# EasyEDA Pro project Blaster.eprj

# Schematic Blaster
Board Name: Blaster; Create Date: 2022-11-13; Page Name: Core; Project Name: Blaster; Schematic Name: Blaster; Update Date: 2023-08-04; Company: 嘉立创EDA; Page Size: A4; Version: V1.0
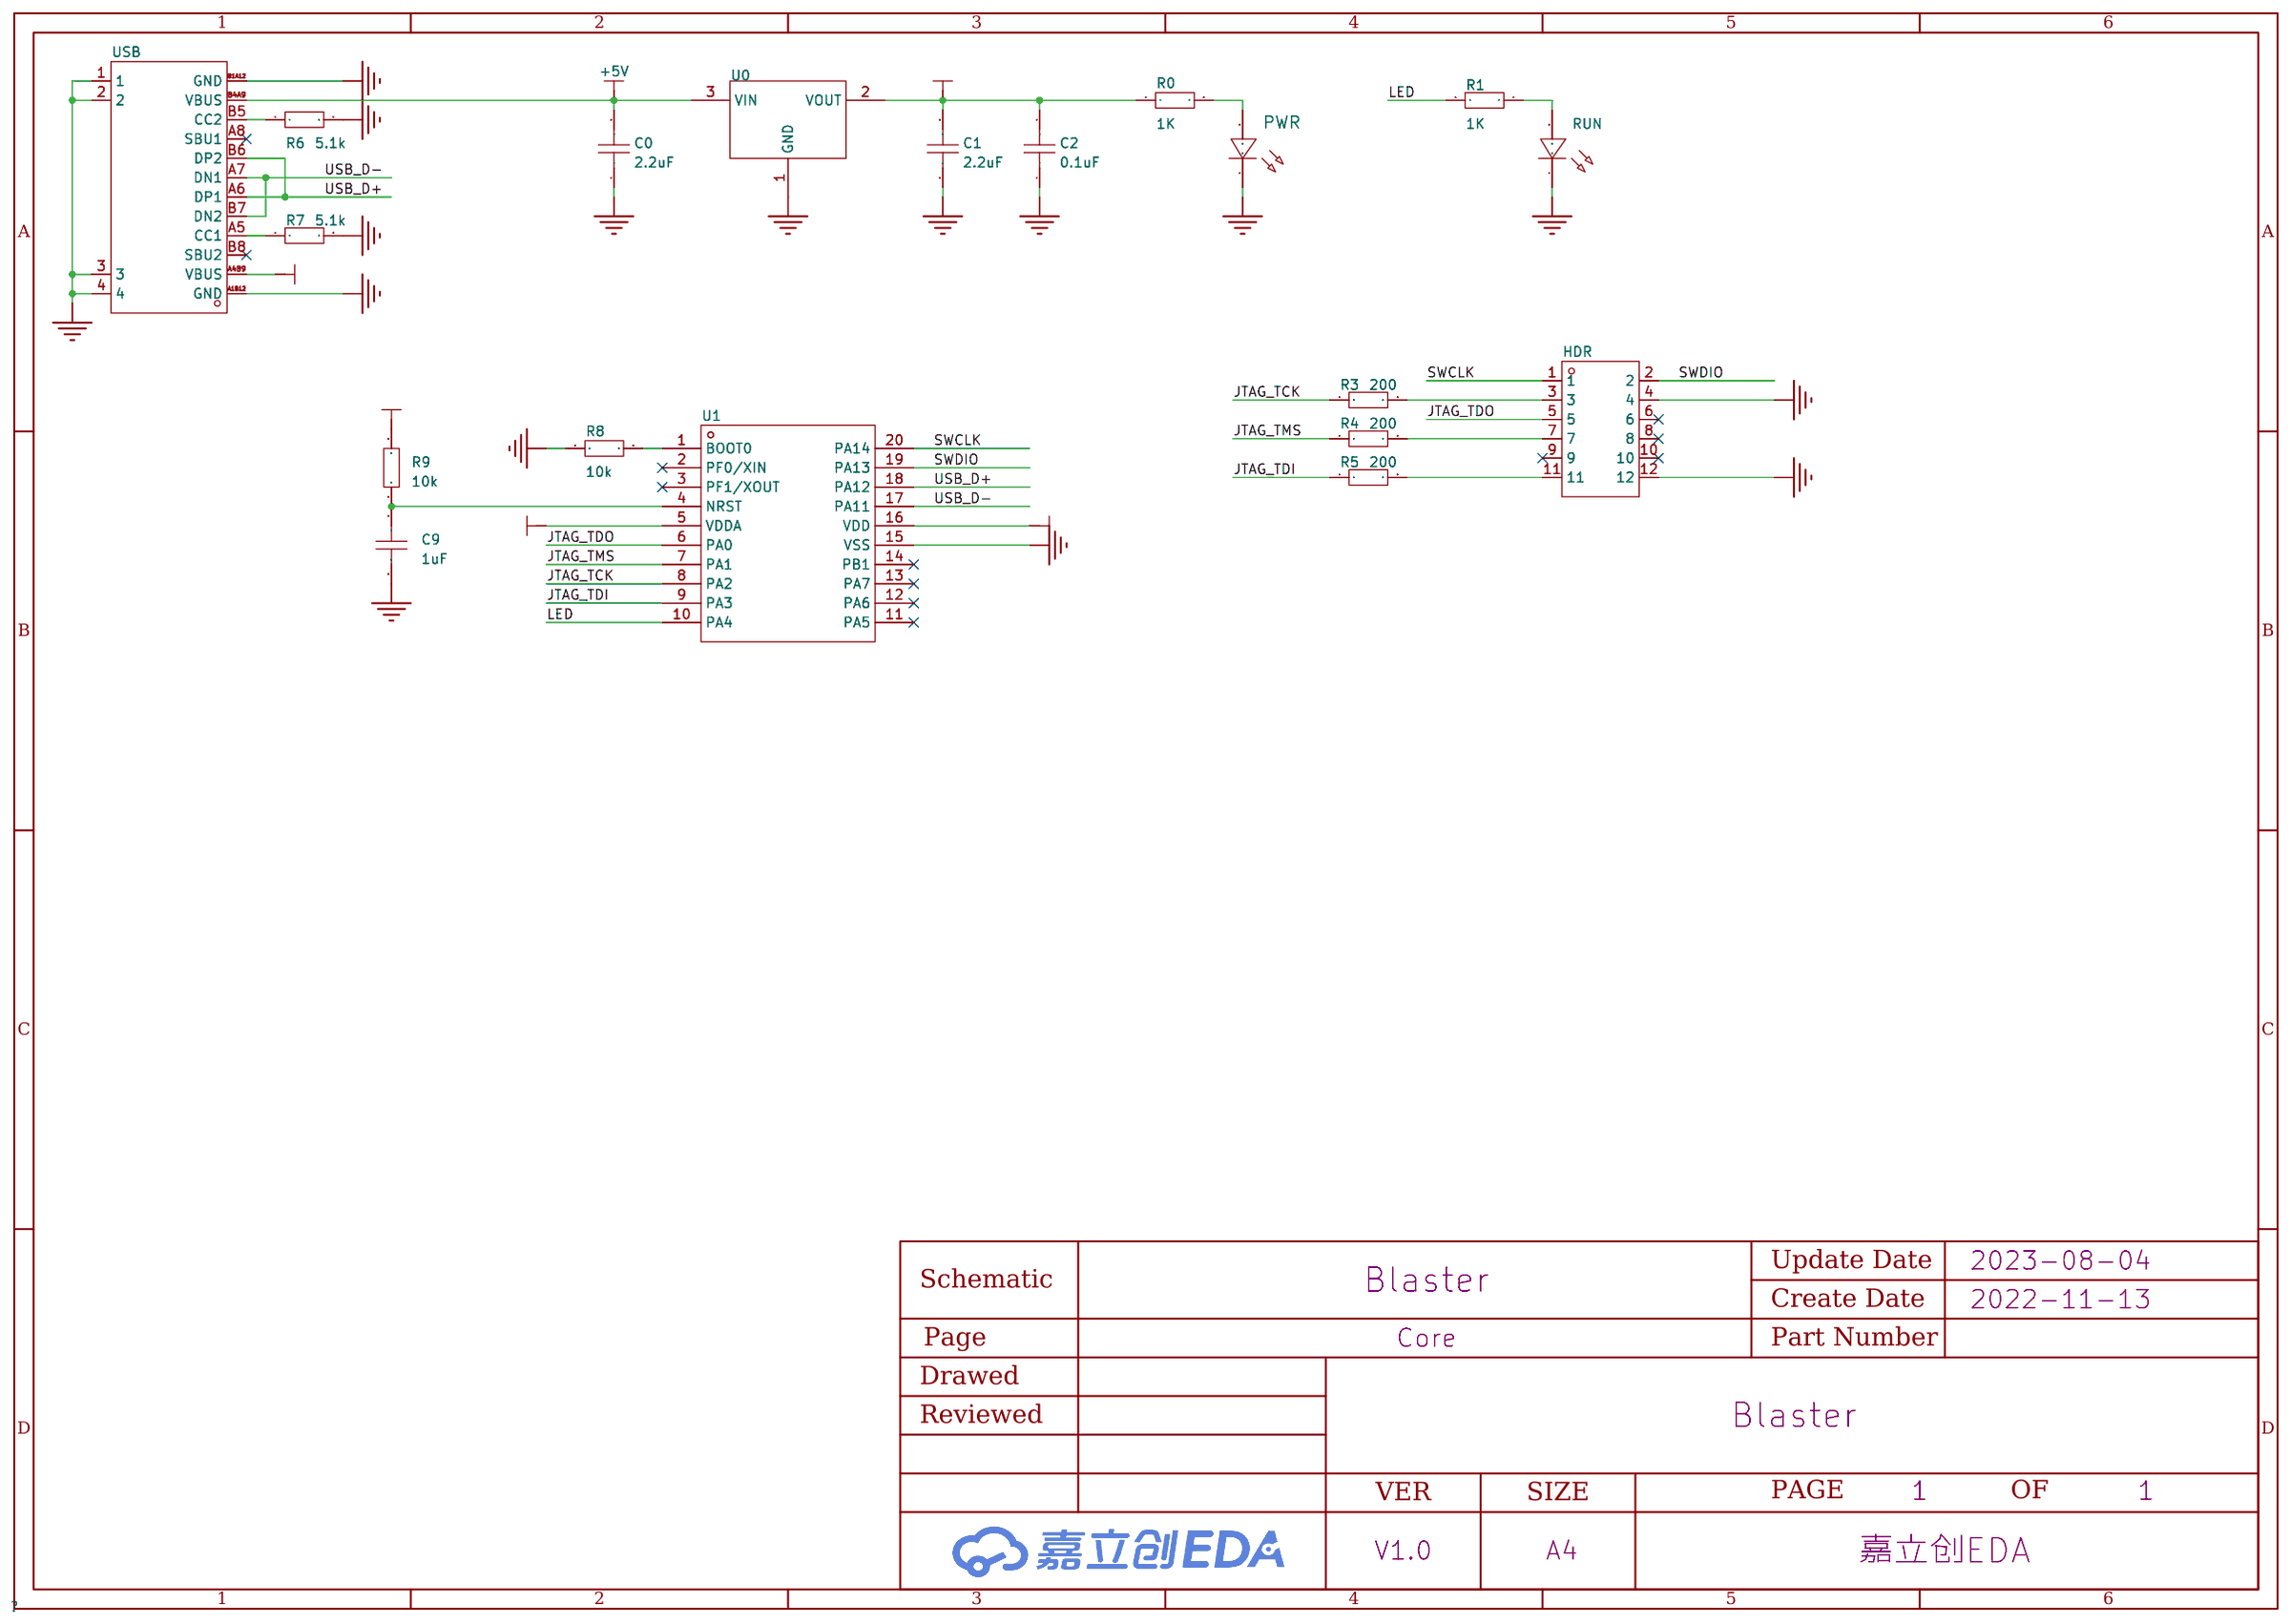
[diagram p0: schematic sheet]

## Parts
C0  2.2uF  [C0603]
C1  2.2uF  [C0603]
C2  0.1uF  [C0603]
C9  1uF  [C0603]
HDR  -  [HDR-SMD_2X6P-P2.54]
PWR  -  [LED0603-RD_BLUE]
R0  1K  [R0603]
R1  1K  [R0603]
R3  200  [R0603]
R4  200  [R0603]
R5  200  [R0603]
R6  5.1k  [R0603]
R7  5.1k  [R0603]
R8  10k  [R0603]
R9  10k  [R0603]
RUN  -  [LED0603-RD]
U0  HT7233  [SOT-23-3_L2.9-W1.6-P1.90-LS2.8-BR]
U1  -  [TSSOP-20_L6.5-W4.4-P0.65-LS6.4-BL]
USB  USB-TYPE-C-017  [USB-TYPE-C-SMD_C9900008089]

## Library data of the parts
C0-C2 C9 = CAP_0603: 容值:100nF;精度:±10%;额定电压:50V;温度系数:X7R;; Supplier Footprint: 0603
HDR = HDR-M_2.54_2x6: Supplier Part: C30734; Supplier Footprint: 插件,P=2.54mm
PWR = LED_0603-R: 发光颜色:红灯;二极管配置:-;透镜颜色:无色透明;主波长:617.5nm;峰值波长:632nm;色温:-;光通量(25时):-;测试电流:5mA;正向电压(VF):2.2V;发光强度:28.5mcd;功率:60mW;发光角度:120°;安装方式:-;工作温度:-40~+85;; Supplier Footprint: 0603; Supplier Part: C72044
R0 R1 R3-R9 = Res_0603: Supplier Footprint: 0603
RUN = LED_0603-G: 照明颜色:翠绿;色温 - CCT（K）:-;主波长/色坐标:520~535nm;; Supplier Footprint: 0603; Supplier Part: C72043
U0 = HT7233: 输出类型:固定;输出极性:正;输出通道数:1;最大输入电压:8V;输出电压:3.3V;压差:300mV@(300mA);静态电流(地电流):-;输出电流:300mA;电源纹波抑制比(PRSS):-;; LCSC Part Name: Vin=8V Vout=3.3V 300mA; Supplier Part: C47970; Manufacturer: HOLTEK(台湾合泰/盛群); Supplier Footprint: SOT-23(SOT-23-3); JLCPCB Part Class: 扩展库; Datasheet: https://atta.szlcsc.com/upload/public/pdf/source/20150618/1457707321217.pdf; Supplier: LCSC; Output Type: 固定; Output Polarity: 正; Number of Outputs: 1; Maximum Input Voltage: 8V; Output Voltage: 3.3V; Dropout Voltage: 300mV@(300mA); Output Current: 300mA
U1 = AT32F425F8
USB = USB-TYPE-C-017: 连接器类型:Type-C;标准:-;公母:母座;触点数量:16;端口数量:1;安装方式:卧贴;额定电流 - 电源:3A;工作温度范围:-25~+85;; Supplier Part: C2927037; Manufacturer: DEALON(德艺隆); Supplier Footprint: SMD; JLCPCB Part Class: 扩展库; Datasheet: https://atta.szlcsc.com/upload/public/pdf/source/20211217/653222EE5174722C9DFE2966329956D8.pdf; Supplier: LCSC; Connector Type: Type-C; Gender: 母座; Number of Contacts: 16; Number of Ports: 1; Mounting Style: 卧贴; Current Rating - Power (Max): 3A; Operating Temperature Range: -25~+85

## Nets
+3.3V: C1.2 C2.2 R0.1 R9.2 U0.2(VOUT) U1.5(VDDA) U1.16(VDD)
+5V: C0.2 U0.3(VIN) USB.A4B9(VBUS) USB.B4A9(VBUS)
GND: C0.1 C1.1 C2.1 C9.2 HDR.4 HDR.12 PWR.1(C) R6.2 R7.2 R8.1 RUN.1(C) U0.1(GND) U1.15(VSS) USB.1 USB.2 USB.3 USB.4 USB.A1B12(GND) USB.B1A12(GND)
JTAG_TCK: R3.1 U1.8(PA2)
JTAG_TDI: R5.1 U1.9(PA3)
JTAG_TDO: HDR.5 U1.6(PA0)
JTAG_TMS: R4.1 U1.7(PA1)
LED: R1.2 U1.10(PA4)
SWCLK: HDR.1 U1.20(PA14)
SWDIO: HDR.2 U1.19(PA13)
USB_D+: U1.18(PA12) USB.A6(DP1) USB.B6(DP2)
USB_D-: U1.17(PA11) USB.A7(DN1) USB.B7(DN2)
$1N2511: R7.1 USB.A5(CC1)
$1N2512: R6.1 USB.B5(CC2)
$1N2528: PWR.2(A) R0.2
$1N2541: C9.1 R9.1 U1.4(NRST)
$1N2568: HDR.7 R4.2
$1N2571: HDR.3 R3.2
$1N2578: HDR.11 R5.2
$1N4668: R8.2 U1.1(BOOT0)
$1N8802: R1.1 RUN.2(A)

Not connected (* = marked no-connect by the designer): HDR 6* 8* 9* 10*; U1 2(PF0/XIN)* 3(PF1/XOUT)* 11(PA5)* 12(PA6)* 13(PA7)* 14(PB1)*; USB A8(SBU1)* B8(SBU2)*

# Board Blaster
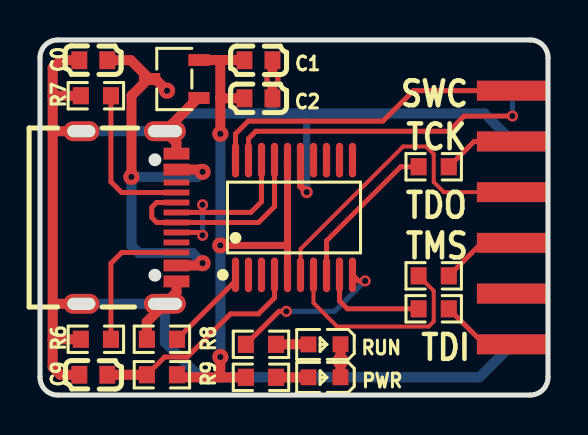
[diagram p1: board, top side]
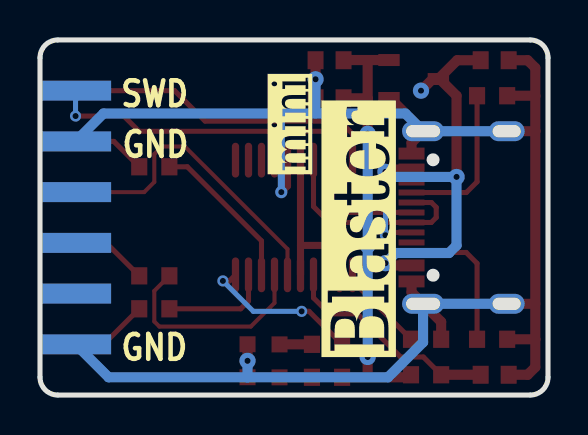
[diagram p2: board, bottom side, seen from below]

Outline 25.4 x 17.78 mm; copper layers: Top Layer, Bottom Layer. Coordinates in mm from the lower left corner of the outline.
Outline path: 0,16.89 0,0.89 arc(0.26,0.26) 0.89,0 24.51,0 arc(25.14,0.26) 25.4,0.89 25.4,16.89 arc(25.14,17.52) 24.51,17.78 0.89,17.78 arc(0.26,17.52) 0,16.89
Stack: Top Layer 0.035mm / Dielectric1 1.51mm FR4 er 4.5 / Bottom Layer 0.035mm

## Design rules (mm)
spacing safeClearance (default): track to track 0.152, other pairs 0.152 to 0.3
track width trackWidth (default): min 0.127, default 0.254, max 2.54
differential pair differentialPair (default): width min 0.127, default 0.254, max 2.54; gap min 0.152, default 0.152
via viaSize (default): diameter min 0.5, default 0.61, max 10; hole min 0.3, default 0.305, max 6

## Placement (name value [footprint] x y rotation side)
C0  2.2uF  [C0603]  2.67 16.76 0 top
C1  2.2uF  [C0603]  10.92 16.76 180 top
C2  0.1uF  [C0603]  10.92 14.86 180 top
C9  1uF  [C0603]  2.67 1.02 180 top
HDR  -  [HDR-SMD_2X6P-P2.54]  23.62 15.24 0 top
PWR  -  [LED0603-RD_BLUE]  14.22 0.89 180 top
R0  1K  [R0603]  11.05 0.89 0 top
R1  1K  [R0603]  11.05 2.54 180 top
R3  200  [R0603]  19.69 11.43 0 top
R4  200  [R0603]  19.69 5.97 0 top
R5  200  [R0603]  19.69 4.32 0 top
R6  5.1k  [R0603]  2.79 2.79 180 top
R7  5.1k  [R0603]  2.79 14.99 180 top
R8  10k  [R0603]  6.1 2.79 0 top
R9  10k  [R0603]  6.1 1.02 0 top
RUN  -  [LED0603-RD]  14.22 2.54 180 top
U0  HT7233  [SOT-23-3_L2.9-W1.6-P1.90-LS2.8-BR]  6.72 15.82 0 top
U1  -  [TSSOP-20_L6.5-W4.4-P0.65-LS6.4-BL]  12.7 8.89 0 top
USB  USB-TYPE-C-017  [USB-TYPE-C-SMD_C9900008089]  4.44 8.89 270 top

## Footprints (pads in the part's own frame, mm; a bottom-side part is the same pattern mirrored in y, then rotated)
C0603
  rect 0.8x0.9 smd: 1(-0.7,0) 2(0.7,0)
HDR-SMD_2X6P-P2.54
  rect 3.556x1 smd: 1(0,0) 3(0,-2.54) 5(0,-5.08) 7(0,-7.62) 9(0,-10.16) 11(0,-12.7)
  rect 3.556x1 smd far side: 2(0,0) 4(0,-2.54) 6(0,-5.08) 8(0,-7.62) 10(0,-10.16) 12(0,-12.7)
LED0603-RD
  rect 0.8x0.8 smd: 1(-0.799,-0.004) 2(0.799,0.004)
LED0603-RD_BLUE
  rect 0.8x0.8 smd: 1(-0.8,-0.003) 2(0.8,0.003)
R0603
  rect 0.806x0.864 smd: 1(-0.753,0) 2(0.753,0)
SOT-23-3_L2.9-W1.6-P1.90-LS2.8-BR
  rect 1.07x0.6 smd: 1(1.235,-0.95) 2(1.235,0.95) 3(-1.235,0)
TSSOP-20_L6.5-W4.4-P0.65-LS6.4-BL
  oval 0.364x1.742 smd: 1(-2.925,-2.871) 2(-2.275,-2.871) 3(-1.625,-2.871) 4(-0.975,-2.871) 5(-0.325,-2.871) 6(0.325,-2.871) 7(0.975,-2.871) 8(1.625,-2.871) 9(2.275,-2.871) 10(2.925,-2.871) 11(2.925,2.871) 12(2.275,2.871) 13(1.625,2.871) 14(0.975,2.871) 15(0.325,2.871) 16(-0.325,2.871) 17(-0.975,2.871) 18(-1.625,2.871) 19(-2.275,2.871) 20(-2.925,2.871)
USB-TYPE-C-SMD_C9900008089
  oval 1x2.1 hole 0.6x1.7: 1(-4.32,1.801) 2(4.32,1.801)
  oval 1x1.8 hole 0.6x1.4: 3(-4.32,-2.379) 4(4.32,-2.379)
  rect 0.6x1.3 smd: A1B12(-3.2,2.379) A4B9(-2.4,2.379) B1A12(3.2,2.379) B4A9(2.4,2.379)
  rect 0.3x1.3 smd: A5(-1.25,2.379) A6(-0.25,2.379) A7(0.25,2.379) A8(1.25,2.379) B5(1.75,2.379) B6(0.75,2.379) B7(-0.75,2.379) B8(-1.75,2.379)

## Nets
As in the schematic.

Pads without a net: HDR 6 8 9 10; U1 2 3 11 12 13 14; USB A8 B8

## Via types
v1: diameter 0.813, hole 0.305, Top Layer to Bottom Layer, 9 vias
v2: diameter 0.61, hole 0.305, Top Layer to Bottom Layer, 1 via
v3: diameter 0.559, hole 0.305, Top Layer to Bottom Layer, 5 vias

## Routing (per net, layer and track width the routed paths; a pad name or vN(x,y) marks a point on that pad's centre or on a via; arc(x,y) is an arc through that point)
+3.3V: length 32
  Top Layer w0.355: 12.38,7.49 12.37,7.49 v1(9.02,7.49) ; 12.38,7.49 U1.16 ; 12.38,7.49 U1.5
  Top Layer w0.508: R9.2 6.98,0.89 9.02,0.89 ; v1(9.02,1.91) 9.02,0.89 9.02,0.89 ; 9.02,0.89 R0.1 ; C2.2 9.02,14.86 9.02,14.86 ; C1.2 10.21,16.77 U0.2 ; 9.02,14.86 9.02,16.77 ; 9.02,14.86 v1(9.02,13.08)
  Bottom Layer w0.508: v1(9.02,13.08) v1(9.02,7.49) v1(9.02,1.91)
+5V: length 22.7
  Top Layer w0.508: U0.3 5.41,15.82 4.57,14.99 v1(4.57,10.92) ; U0.3 5.77,15.82 v1(6.35,15.24) ; U0.3 4.54,16.76 C0.2 ; v1(8.13,6.6) 8.01,6.49 USB.B4A9 ; v1(8.13,11.18) 8.01,11.29 USB.A4B9
  Bottom Layer w0.508: v1(8.13,11.18) 7.87,10.92 v1(4.57,10.92) 4.57,7.49 4.95,7.11 7.62,7.11 v1(8.13,6.6)
GND: length 90.1
  Top Layer w0.355: v2(13.34,10.16) 13.03,10.47 U1.15
  Top Layer w0.508: 0.63,13.22 0.63,2.79 ; 0.63,13.22 0.64,13.21 USB.3 ; 0.63,13.22 0.63,14.97 ; 0.63,2.79 0.63,1.4 1.02,1.02 C9.2 ; 0.63,2.79 0.64,2.79 R6.2 ; R7.2 0.65,14.99 0.63,14.97 ; 0.63,14.97 0.63,16.38 1.02,16.76 C0.1 ; USB.4 0.64,4.57 ; U0.1 7.91,14.87 USB.1 6.82,12.63 USB.A1B12 ; USB.B1A12 6.82,5.15 USB.2 5.34,3.67 R8.1 ; C1.1 C2.1 ; PWR.1 RUN.1
  Bottom Layer w0.355: v2(13.34,10.16) 13.34,14.09
  Bottom Layer w0.508: 15.03,0.89 8,0.89 6.25,2.64 USB.2 USB.4 ; 15.03,0.89 21.97,0.89 HDR.12 ; 15.03,0.89 PWR.1 v1(15.02,1.71) ; USB.3 USB.1 7.13,14.1 22.22,14.1 HDR.4 ; v1(11.62,15.81) 11.62,14.1
JTAG_TCK: length 7.8
  Top Layer w0.254: U1.8 14.32,7.72 18.03,11.43 R3.1
JTAG_TDI: length 5.4
  Top Layer w0.254: U1.9 14.97,4.71 15.37,4.32 R5.1
JTAG_TDO: length 15.8
  Top Layer w0.203: U1.6 13.03,7.31 18.16,12.45 19.3,12.45 19.69,12.06 19.69,10.67 20.19,10.16 HDR.5
JTAG_TMS: length 10.6
  Top Layer w0.203: R4.1 19.69,5.22 19.69,3.68 19.43,3.43 14.86,3.43 13.68,4.61 13.68,6.02
LED: length 8
  Top Layer w0.254: U1.10 15.93,5.72 v3(16.26,5.72) ; R1.2 11.95,4.19 v3(12.32,4.19)
  Bottom Layer w0.254: v3(16.26,5.72) 14.73,4.19 v3(12.32,4.19)
SWCLK: length 16.1
  Top Layer w0.254: HDR.1 18.67,15.24 17.15,13.72 10.41,13.72 9.78,13.08 9.78,11.76
SWDIO: length 16
  Top Layer w0.254: v3(23.62,13.97) 21.21,13.97 20.45,13.21 10.79,13.21 10.43,12.84 U1.19
  Bottom Layer w0.254: v3(23.62,13.97) HDR.2
USB_D+: length 9.8
  Top Layer w0.254: 8.13,9.14 6.83,9.14 USB.A6 ; 8.13,9.14 10.54,9.14 11.07,9.68 U1.18 ; 8.13,9.14 8.13,9.15 v3(8.13,9.53) ; v3(8.13,8) 7.99,8.14 USB.B6
  Bottom Layer w0.254: v3(8.13,8) v3(8.13,9.53)
USB_D-: length 10.7
  Top Layer w0.254: U1.17 11.72,9.44 10.93,8.64 USB.A7 5.84,8.64 5.59,8.89 5.59,9.4 5.83,9.64 USB.B7
$1N2511: length 7.8
  Top Layer w0.254: R7.1 3.55,10.68 4.08,10.14 USB.A5
$1N2512: length 7.3
  Top Layer w0.254: R6.1 3.55,6.6 4.09,7.14 USB.B5
$1N2528: length 1.6
  Top Layer w0.508: PWR.2 13.42,0.89 R0.2
$1N2541: length 11.1
  Top Layer w0.254: R9.1 6.23,1.91 7.37,1.91 9.53,4.06 10.92,4.06 11.72,4.87 U1.4
  Top Layer w0.508: C9.1 R9.1
$1N2568: length 3.9
  Top Layer w0.254: HDR.7 22.09,7.62 R4.2
$1N2571: length 3.7
  Top Layer w0.254: R3.2 21.71,12.7 HDR.3
$1N2578: length 3.9
  Top Layer w0.254: HDR.11 22.22,2.54 R5.2
$1N4668: length 4.4
  Top Layer w0.254: R8.2 9.78,5.72 9.78,6.02
$1N8802: length 1.6
  Top Layer w0.508: RUN.2 13.42,2.54 R1.1

## Text on the board
Bottom Silkscreen Layer: GND | SWD | mini | Blaster
Top Silkscreen Layer: SWC | TDO | TMS | TCK | TDI
